# EAGLE design PaddleClock-base-v1b (EAGLE 5.06)
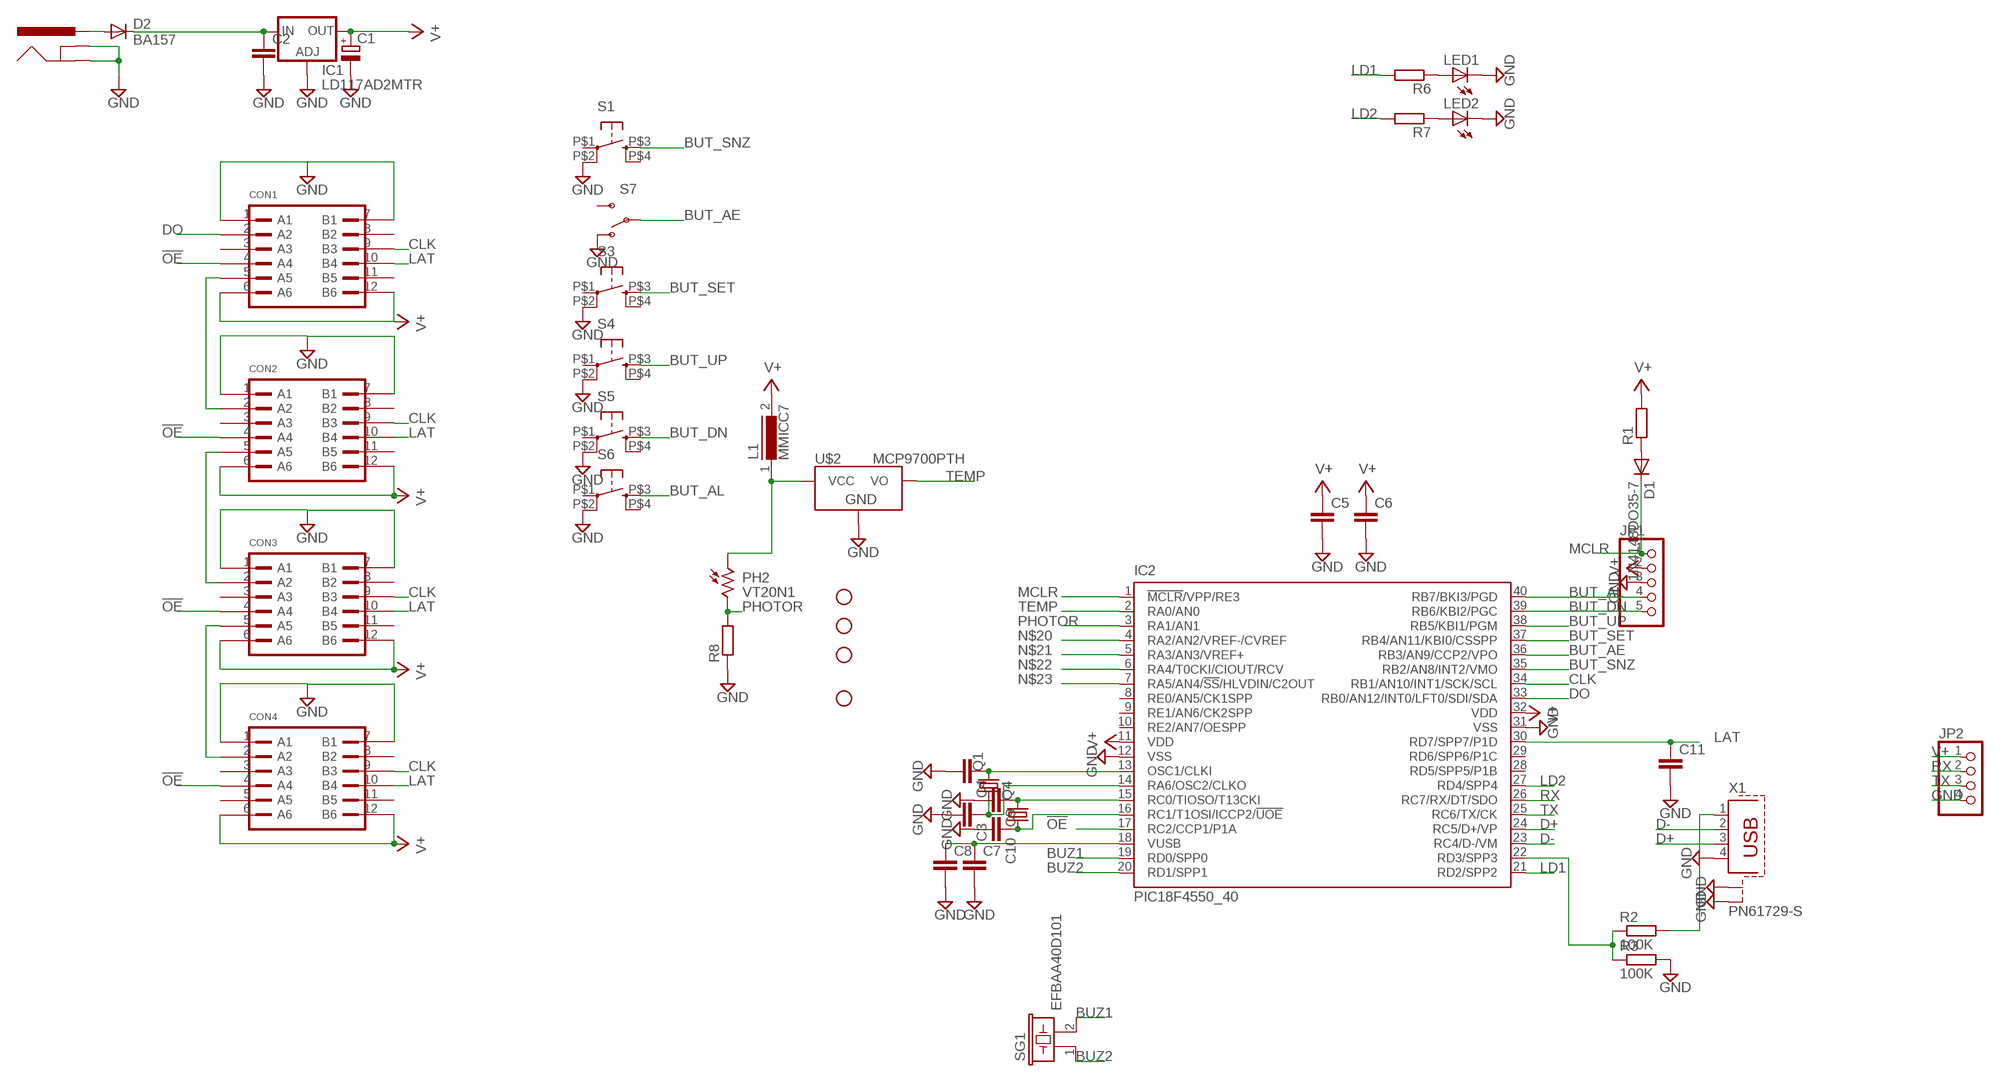
[diagram p0: schematic, sheet 1]

## Parts
C1  CPOL-EUE2.5-7  [E2,5-7]
C2  C-EU025-024X044  [C025-024X044]
C3  C-EU025-024X044  [C025-024X044]
C4  C-EU025-024X044  [C025-024X044]
C5  C-EU025-024X044  [C025-024X044]
C6  C-EU025-024X044  [C025-024X044]
C7  C-EU025-024X044  [C025-024X044]
C8  C-EU025-024X044  [C025-024X044]
C9  C-EU025-024X044  [C025-024X044]
C10  C-EU025-024X044  [C025-024X044]
C11  C-EU025-024X044  [C025-024X044]
CON1  EDGE_CONNECTOR_6X2  [EDGE_CONNECTOR_6X2]
CON2  EDGE_CONNECTOR_6X2  [EDGE_CONNECTOR_6X2]
CON3  EDGE_CONNECTOR_6X2  [EDGE_CONNECTOR_6X2]
CON4  EDGE_CONNECTOR_6X2  [EDGE_CONNECTOR_6X2]
D1  1N4148DO35-7  [DO35-7]
D2  BA157  [P1-10]
IC1  LD117AD2MTR  [D2PACK]
IC2  PIC18F4550_40  [DIL40]
J1  POWER_JACKSMD  [POWER_JACK_SMD]
JP1  PINHD-1X5  [1X05]
JP2  PINHD-1X4  [1X04]
L1  MMICC7  [MMICC7]
LED1  LED3MM  [LED3MM]
LED2  LED3MM  [LED3MM]
PH2  VT20N1  [TO46-VT200]
Q1  CRYSTALHC49U-V  [HC49U-V]
Q4  CRYSTALTC26H  [TC26H]
R1  R-EU_0204/7  [0204/7]
R2  100K  R-EU_0204/7  [0204/7]
R3  100K  R-EU_0204/7  [0204/7]
R6  R-EU_0204/7  [0204/7]
R7  R-EU_0204/7  [0204/7]
R8  R-EU_0204/7  [0204/7]
S1  TAC_SWITCHKSA_SEALED  [KSA_SEALED_TAC_SWITCH]
S3  TAC_SWITCHKSA_SEALED  [KSA_SEALED_TAC_SWITCH]
S4  TAC_SWITCHKSA_SEALED  [KSA_SEALED_TAC_SWITCH]
S5  TAC_SWITCHKSA_SEALED  [KSA_SEALED_TAC_SWITCH]
S6  TAC_SWITCHKSA_SEALED  [KSA_SEALED_TAC_SWITCH]
S7  SWITCH-SPSTPTH  [SWITCH-SPDT]
SG1  EFBAA40D101  [EFBAA40D101]
U$1  STAND-OFF  [STAND-OFF]
U$2  MCP9700PTH  [TO-92]
U$3  STAND-OFF  [STAND-OFF]
U$4  STAND-OFF  [STAND-OFF]
U$5  STAND-OFF  [STAND-OFF]
X1  PN61729-S  [PN61729-S]

## Nets
!OE: CON1.4(A4) CON2.4(A4) CON3.4(A4) CON4.4(A4) IC2.17(RC2/CCP1/P1A)
BUT_AE: IC2.36(RB3/AN9/CCP2/VPO) S7.2(P)
BUT_AL: IC2.40(RB7/BKI3/PGD) JP1.4 S6.P$3
BUT_DN: IC2.39(RB6/KBI2/PGC) JP1.5 S5.P$3
BUT_SET: IC2.37(RB4/AN11/KBI0/CSSPP) S3.P$3
BUT_SNZ: IC2.35(RB2/AN8/INT2/VMO) S1.P$3
BUT_UP: IC2.38(RB5/KBI1/PGM) S4.P$3
BUZ1: IC2.19(RD0/SPP0) SG1.2
BUZ2: IC2.20(RD1/SPP1) SG1.1
CLK: CON1.9(B3) CON2.9(B3) CON3.9(B3) CON4.9(B3) IC2.34(RB1/AN10/INT1/SCK/SCL)
D+: IC2.24(RC5/D+/VP) X1.3
D-: IC2.23(RC4/D-/VM) X1.2
DO: CON1.2(A2) IC2.33(RB0/AN12/INT0/LFT0/SDI/SDA)
GND: C1.- C2.2 C3.2 C4.2 C5.2 C6.2 C7.2 C8.2 C9.2 C10.2 C11.2 CON1.1(A1) CON1.7(B1) CON2.1(A1) CON2.7(B1) CON3.1(A1) CON3.7(B1) CON4.1(A1) CON4.7(B1) IC1.1(ADJ) IC2.12(VSS) IC2.31(VSS) J1.GND(GNDBREAK) J1.P$4(GND) JP1.3 JP2.4 LED1.K(C) LED2.K(C) R3.2 R8.1 S1.P$2 S3.P$2 S4.P$2 S5.P$2 S6.P$2 S7.1(O) U$2.3(GND) X1.4 X1.S1 X1.S2
LAT: C11.1 CON1.10(B4) CON2.10(B4) CON3.10(B4) CON4.10(B4) IC2.30(RD7/SPP7/P1D)
LD1: IC2.21(RD2/SPP2) R6.2
LD2: IC2.27(RD4/SPP4) R7.2
MCLR: D1.C IC2.1(!MCLR!/VPP/RE3) JP1.1
N$3: CON1.5(A5) CON2.2(A2)
N$4: C2.1 D2.C IC1.3(IN)
N$5: CON3.5(A5) CON4.2(A2)
N$8: D1.A R1.1
N$9: R2.2 X1.1
N$10: IC2.22(RD3/SPP3) R2.1 R3.1
N$11: L1.1 PH2.1 U$2.1(VCC)
N$14: LED1.A R6.1
N$15: C7.1 C8.1 IC2.18(VUSB)
N$16: CON2.5(A5) CON3.2(A2)
N$18: LED2.A R7.1
N$20: IC2.4(RA2/AN2/VREF-/CVREF)
N$21: IC2.5(RA3/AN3/VREF+)
N$22: IC2.6(RA4/T0CKI/CIOUT/RCV)
N$23: IC2.7(RA5/AN4/!SS!/HLVDIN/C2OUT)
N$24: D2.A J1.VIN0(PWR)
N$26: C9.1 IC2.15(RC0/TIOSO/T13CKI) Q4.2
N$27: C10.1 IC2.16(RC1/T1OSI/ICCP2/!UOE) Q4.1
N$28: C3.1 IC2.14(RA6/OSC2/CLKO) Q1.1
N$29: C4.1 IC2.13(OSC1/CLKI) Q1.2
PHOTOR: IC2.3(RA1/AN1) PH2.2 R8.2
RX: IC2.26(RC7/RX/DT/SDO) JP2.2
TEMP: IC2.2(RA0/AN0) U$2.2(VO)
TX: IC2.25(RC6/TX/CK) JP2.3
V+: C1.+ C5.1 C6.1 CON1.6(A6) CON1.12(B6) CON2.6(A6) CON2.12(B6) CON3.6(A6) CON3.12(B6) CON4.6(A6) CON4.12(B6) IC1.2(OUT) IC2.11(VDD) IC2.32(VDD) JP1.2 JP2.1 L1.2 R1.2
Unconnected: CON1.3(A3) CON1.8(B2) CON1.11(B5) CON2.3(A3) CON2.8(B2) CON2.11(B5) CON3.3(A3) CON3.8(B2) CON3.11(B5) CON4.3(A3) CON4.5(A5) CON4.8(B2) CON4.11(B5) IC2.8(RE0/AN5/CK1SPP) IC2.9(RE1/AN6/CK2SPP) IC2.10(RE2/AN7/OESPP) IC2.28(RD5/SPP5/P1B) IC2.29(RD6/SPP6/P1C) S1.P$1 S1.P$4 S3.P$1 S3.P$4 S4.P$1 S4.P$4 S5.P$1 S5.P$4 S6.P$1 S6.P$4 S7.3(S)

## Library data of the parts
C1 = rcl:CPOL-EU: POLARIZED CAPACITOR, European symbol
C2-C11 = rcl:C-EU: CAPACITOR, European symbol
CON1-CON4 = dp_devices:EDGE_CONNECTOR_6X2
D1 = diode:1N4148: DIODE high speed (Philips)
D2 = diode:BA157: DIODE fast soft-recovery controlled avalanche rectifier
IC1 = v-reg:LD117A?*: Low drop fixed and adjustable positive voltage regulators 1 A Source: http://www.st.com/stonline/products/literature/ds/7194/ld1117axx.pdf
IC2 = microchip:PIC18F4*_40: USB Microcontrollers with nanoWatt Technology High-Performance, Enhanced Flash, 28/40/44-Pin, Source: http://ww1.microchip.com/downloads/en/devicedoc/39632c.pdf
J1 = SparkFun:POWER_JACK: Power Jack This is the standard 5.5mm barrel jack for power. The PTH is the most common, proven, reliable, footprint. All others are experimental. The Slot footprint only works if the mill layer is transmitted to the PCB fab house so be warned. Spark Fun Electronics SKU : PRT-00119. Mating wall wart : TOL-00298 (and others)
JP1 = pinhead-2:PINHD-1X5: PIN HEADER
JP2 = pinhead-2:PINHD-1X4: PIN HEADER
L1 = inductors:MMICC7: INDUCTOR
LED1 LED2 = led:LED: LED OSRAM: - CHIPLED LG R971, LG N971, LY N971, LG Q971, LY Q971, LO R971, LY R971 LH N974, LH R974 LS Q976, LO Q976, LY Q976 LO Q996 - Hyper CHIPLED LW Q18S LB Q993, LB Q99A, LB R99A - SideLED LS A670, LO A670, LY A670, LG A670, LP A670 LB A673, LV A673, LT A673, LW A673 LH A674 LY A675 LS A676, LA A676, LO A676, LY A676, LW A676 LS A679, LY A679, LG A679 - Hyper Micro SIDELED® LS Y876, LA Y876, LO Y876, LY Y876 LT Y87S - SmartLED LW L88C, LW L88S LB L89C, LB L89S, LG L890 LS L89K, LO L89K, LY L89K LS L896, LA L896, LO L896, LY L896 - TOPLED LS T670, LO T670, LY T670, LG T670, LP T670 LSG T670, LSP T670, LSY T670, LOP T670, LYG T670 LG T671, LOG T671, LSG T671 LB T673, LV T673, LT T673, LW T673 LH T674 LS T676, LA T676, LO T676, LY T676, LB T676, LH T676, LSB T676, LW T676 LB T67C, LV T67C, LT T67C, LS T67K, LO T67K, LY T67K, LW E67C LS E67B, LA E67B, LO E67B, LY E67B, LB E67C, LV E67C, LT E67C LW T67C LS T679, LY T679, LG T679 LS T770, LO T770, LY T770, LG T770, LP T770 LB T773, LV T773, LT T773, LW T773 LH T774 LS E675, LA E675, LY E675, LS T675 LS T776, LA T776, LO T776, LY T776, LB T776 LHGB T686 LT T68C, LB T68C - Hyper Mini TOPLED® LB M676 - Mini TOPLED Santana® LG M470 LS M47K, LO M47K, LY M47K Source: http://www.osram.convergy.de LUXEON: - LUMILED® LXK2-PW12-R00, LXK2-PW12-S00, LXK2-PW14-U00, LXK2-PW14-V00 LXK2-PM12-R00, LXK2-PM12-S00, LXK2-PM14-U00 LXK2-PE12-Q00, LXK2-PE12-R00, LXK2-PE12-S00, LXK2-PE14-T00, LXK2-PE14-U00 LXK2-PB12-K00, LXK2-PB12-L00, LXK2-PB12-M00, LXK2-PB14-N00, LXK2-PB14-P00, LXK2-PB14-Q00 LXK2-PR12-L00, LXK2-PR12-M00, LXK2-PR14-Q00, LXK2-PR14-R00 LXK2-PD12-Q00, LXK2-PD12-R00, LXK2-PD12-S00 LXK2-PH12-R00, LXK2-PH12-S00 LXK2-PL12-P00, LXK2-PL12-Q00, LXK2-PL12-R00 Source: www.luxeon.com KINGBRIGHT: KA-3528ASYC Source: www.kingbright.com
PH2 = photo-elements:VT2*: Photoconductive Cell VT200 Series Source: http://optoelectronics.perkinelmer.com/content/Datasheets/DTS_vt200seriesdatasheet.pdf
Q1 Q4 = crystal:CRYSTAL: CRYSTAL
R1-R3 R6-R8 = rcl:R-EU_: RESISTOR, European symbol
S1 S3-S6 = SparkFun:TAC_SWITCH: Momentary Switch Button commonly used for reset or general input. Spark Fun Electronics SKU : COM-00097
S7 = SparkFun:SWITCH-SPST: SPST Switch Simple slide switch. Spark Fun Electronics SKU : COM-00102
SG1 = buzzer:EFB?: Piezoelectric Acoustic Transducer Source: Panbasonic .. 2SC1685.pdf
U$1 U$3-U$5 = SparkFun:STAND-OFF: Stand Off This is the mechanical footprint for a #4 phillips button head screw. Use the keepout ring to avoid running the screw head into surrounding components. SKU : PRT-00447
U$2 = SparkFun:MCP9700
X1 = con-berg:PN61729-S: BERG USB connector

## Board
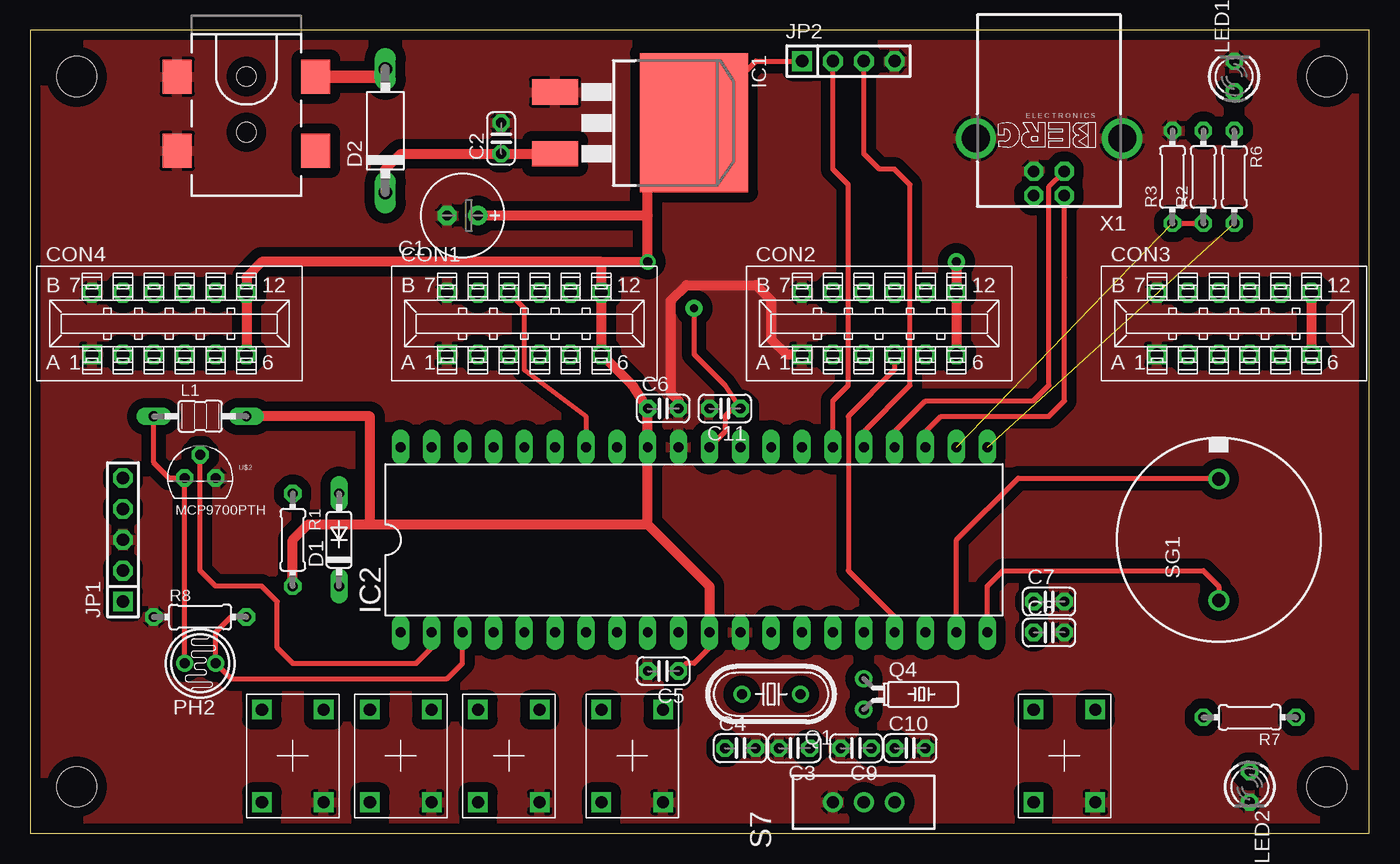
[diagram p1: board, top side]
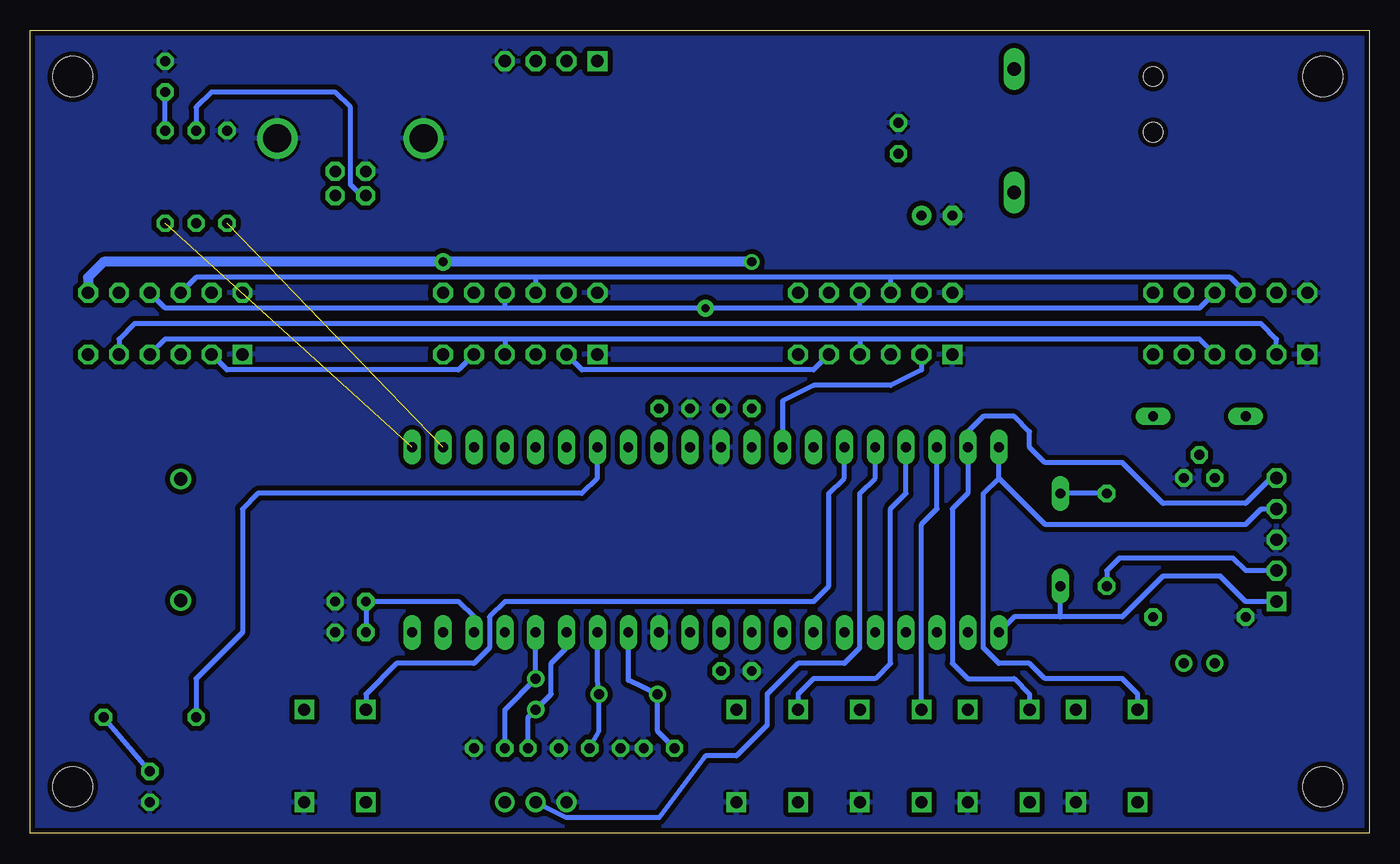
[diagram p2: board, bottom side, seen from below]

Size 110.16 x 66.03 mm. Coordinates in mm from the lower left corner, seen from the top.
Outline: 0,0 110.16,0 110.16,66.03 0,66.03 0,0
Copper layers (1*16): Top 0.035mm / dielectric 1.5mm / Bottom 0.035mm
Design rules "SparkFun": minimum track width 8mil, minimum drill 20mil, track to track 8mil, track to pad 8mil, pad to pad 8mil, via to via 8mil, smd to smd 8mil, copper to edge 10mil, drill to drill 8mil, minimum pad ring 12mil, minimum via ring 10mil, stop-mask expansion 4mil, vias tented up to drill 25mil, thermal gap 10mil

### Footprints (pad centres in the part's own frame; a part is rotated, then mirrored left to right if it is on the bottom)
E2,5-7 = drill 0.813 pad 1.6 round: + -1.27,0 | drill 0.813 pad 1.6 octagon: - 1.27,0
C025-024X044 = drill 0.813 octagon: 1 -1.27,0; 2 1.27,0
EDGE_CONNECTOR_6X2 = drill 1.02 square: 1 -6.35,-2.54 | drill 1.02 octagon: 2 -3.81,-2.54; 3 -1.27,-2.54; 4 1.27,-2.54; 5 3.81,-2.54; 6 6.35,-2.54; 7 -6.35,2.54; 8 -3.81,2.54; 9 -1.27,2.54; 10 1.27,2.54; 11 3.81,2.54; 12 6.35,2.54
DO35-7 = drill 0.813 long: A 3.81,0; C -3.81,0
P1-10 = drill 1.118 long: A 5.08,0; C -5.08,0
D2PACK = smd 2.083 x 3.81: 1 -2.54,-8.89; 3 2.54,-8.89 | smd 11.43 x 8.89: 2 0,2.54
DIL40 = drill 0.813 long: 1 -24.13,-7.62; 2 -21.59,-7.62; 3 -19.05,-7.62; 4 -16.51,-7.62; 5 -13.97,-7.62; 6 -11.43,-7.62; 7 -8.89,-7.62; 8 -6.35,-7.62; 9 -3.81,-7.62; 10 -1.27,-7.62; 11 1.27,-7.62; 12 3.81,-7.62; 13 6.35,-7.62; 14 8.89,-7.62; 15 11.43,-7.62; 16 13.97,-7.62; 17 16.51,-7.62; 18 19.05,-7.62; 19 21.59,-7.62; 20 24.13,-7.62; 21 24.13,7.62; 22 21.59,7.62; 23 19.05,7.62; 24 16.51,7.62; 25 13.97,7.62; 26 11.43,7.62; 27 8.89,7.62; 28 6.35,7.62; 29 3.81,7.62; 30 1.27,7.62; 31 -1.27,7.62; 32 -3.81,7.62; 33 -6.35,7.62; 34 -8.89,7.62; 35 -11.43,7.62; 36 -13.97,7.62; 37 -16.51,7.62; 38 -19.05,7.62; 39 -21.59,7.62; 40 -24.13,7.62
POWER_JACK_SMD = smd 2.8 x 2.4: GND 0,-5.7; P$4 6.1,-5.7; VIN0 0,5.7; VIN1 6.1,5.7 | hole 1.6: 0,0; 4.572,0
1X05 = drill 1.016 square: 1 -5.08,0 | drill 1.016 octagon: 2 -2.54,0; 3 0,0; 4 2.54,0; 5 5.08,0
1X04 = drill 1.016 square: 1 -3.81,0 | drill 1.016 octagon: 2 -1.27,0; 3 1.27,0; 4 3.81,0
MMICC7 = drill 0.813 long: 1 -3.81,0; 2 3.81,0
LED3MM = drill 0.813 octagon: A -1.27,0; K 1.27,0
TO46-VT200 = drill 0.8 pad 1.4 round: 1 -1.27,0; 2 1.27,0
HC49U-V = drill 0.813 round: 1 -2.413,0; 2 2.413,0
TC26H = drill 0.813 round: 1 -1.27,0; 2 1.27,0
0204/7 = drill 0.813 octagon: 1 -3.81,0; 2 3.81,0
KSA_SEALED_TAC_SWITCH = drill 1 square: P$1 -3.81,2.54; P$2 3.81,2.54; P$3 -3.81,-2.54; P$4 3.81,-2.54
SWITCH-SPDT = drill 1.016 round: 1 0,2.54; 2 0,0; 3 0,-2.54
EFBAA40D101 = drill 1.1 pad 1.676 round: 1 -5,0; 2 5,0
STAND-OFF = hole 3.302: 0,0
TO-92 = drill 0.813 octagon: 1 -1.27,0; 2 0,1.905; 3 1.27,0
PN61729-S = drill 0.95 octagon: 1 1.25,4.71; 2 -1.25,4.71; 3 -1.25,2.71; 4 1.25,2.71 | drill 2.3 pad 2.9 round: S1 -6.02,0; S2 6.02,0

### Placement (x,y rotation side)
C1  35.56,50.8 180 top
C2  38.73,57.15 90 top
C3  62.87,6.99 180 top
C4  58.42,6.99 0 top
C5  52.07,13.34 180 top
C6  52.07,34.92 0 top
C7  83.82,19.05 0 top
C8  83.82,16.51 0 top
C9  67.95,6.99 180 top
C10  72.39,6.99 0 top
C11  57.15,34.92 180 top
CON1  40.64,41.91 0 top
CON2  69.85,41.91 0 top
CON3  99.06,41.91 0 top
CON4  11.43,41.91 0 top
D1  25.4,24.13 90 top
D2  29.21,57.78 90 top
IC1  52.07,58.42 270 top
IC2  54.61,24.13 0 top
J1  17.78,62.23 270 top
JP1  7.62,24.13 90 top
JP2  67.31,63.5 0 top
L1  13.97,34.29 0 top
LED1  99.06,62.23 90 top
LED2  100.33,3.81 270 top
PH2  13.97,13.97 0 top
Q1  60.96,11.43 180 top
Q4  68.58,11.43 270 top
R1  21.59,24.13 270 top
R2  96.52,53.98 90 top
R3  93.98,53.98 90 top
R6  99.06,53.98 270 top
R7  100.33,9.53 180 top
R8  13.97,17.78 0 top
S1  85.09,6.35 270 top
S3  49.53,6.35 270 top
S4  39.37,6.35 270 top
S5  30.48,6.35 270 top
S6  21.59,6.35 270 top
S7  68.58,2.54 90 top
SG1  97.79,24.13 90 top
U$1  3.81,62.23 0 top
U$2  13.97,29.21 0 top
U$3  3.81,3.81 0 top
U$4  106.68,3.81 0 top
U$5  106.68,62.23 0 top
X1  83.82,57.15 180 top

### Tracks (layer width: path | path; a pad name or v marks a point on that pad's centre or on a via)
!OE
  Top 0.406: IC2.17 71.12,17.78 67.31,21.59 67.31,34.29 71.12,38.1 CON2.4
  Bottom 0.406: 41.91,40.64 13.97,40.64 CON4.4 | 41.91,40.64 71.12,40.64 | 71.12,40.64 99.06,40.64 CON3.4 | 41.91,40.64 CON1.4 | 71.12,40.64 CON2.4
BUT_AE
  Bottom 0.406: S7.2 66.04,1.27 58.42,1.27 54.61,6.35 52.07,6.35 49.53,8.89 49.53,11.43 46.99,13.97 43.18,13.97 41.91,15.24 41.91,27.94 40.64,29.21 IC2.36
BUT_AL
  Bottom 0.406: S6.P$3 19.05,11.43 20.32,12.7 26.67,12.7 27.94,13.97 30.48,13.97 31.75,15.24 31.75,27.94 30.48,29.21 | 30.48,29.21 IC2.40 | 30.48,29.21 26.67,25.4 10.16,25.4 8.89,26.67 JP1.4
BUT_DN
  Bottom 0.406: S5.P$3 27.94,11.43 29.21,12.7 33.02,12.7 34.29,13.97 34.29,26.67 33.02,27.94 IC2.39 33.02,33.02 31.75,34.29 29.21,34.29 27.94,33.02 27.94,31.75 26.67,30.48 20.32,30.48 16.97,27.13 10.16,27.13 8.08,29.21 JP1.5
BUT_SET
  Bottom 0.406: S3.P$3 46.99,11.43 45.72,12.7 40.64,12.7 39.37,13.97 39.37,26.67 38.1,27.94 IC2.37
BUT_SNZ
  Bottom 0.406: IC2.35 43.18,29.21 44.45,27.94 44.45,20.32 45.72,19.05 71.12,19.05 72.39,17.78 72.39,15.24 73.66,13.97 80.01,13.97 82.55,11.43 S1.P$3
BUT_UP
  Bottom 0.406: S4.P$3 36.83,25.4 35.56,26.67 IC2.38
BUZ1
  Top 0.406: IC2.19 76.2,24.13 81.28,29.21 97.71,29.21 SG1.2
BUZ2
  Top 0.406: IC2.20 78.74,20.32 80.01,21.59 96.52,21.59 97.79,20.32 SG1.1
CLK
  Top 0.406: IC2.34 45.72,34.29 40.64,38.1 40.64,43.18 CON1.9
  Bottom 0.406: CON4.9 11.43,45.72 39.37,45.72 | 39.37,45.72 CON1.9 | 39.37,45.72 68.58,45.72 | 68.58,45.72 CON2.9 | 68.58,45.72 96.52,45.72 CON3.9
D+
  Top 0.406: X1.3 83.82,53.19 83.82,36.83 82.55,35.56 73.66,35.56 71.12,33.02 IC2.24
D-
  Top 0.406: X1.2 85.07,49.55 85.09,45.72 85.09,35.56 83.82,34.29 74.93,34.29 73.66,33.02 IC2.23
DO
  Bottom 0.406: CON1.2 36.83,38.1 39.37,36.83 45.72,36.83 48.26,35.56 IC2.33
GND
  Top 0.813: CON2.1 62.23,39.37 60.96,40.64 60.96,43.81 59.69,45.09 53.98,45.09 52.71,43.81 52.71,36.2 53.34,35.56 C6.2
  pour Bottom (isolate 0.406): 0,66.04 110.49,66.04 110.49,0 0,0
  pour Top (isolate 0.813): 0,66.04 110.49,66.04 110.49,0 0,0
LAT  (via drill 0.64 pad 1.42)
  Top 0.406: IC2.30 57.15,33.02 57.15,34.29 57.79,34.92 C11.1 57.15,36.83 54.61,39.37 v54.61,43.18
  Bottom 0.406: CON4.10 13.97,43.18 41.91,43.18 | 41.91,43.18 CON1.10 | 41.91,43.18 v54.61,43.18 71.12,43.18 | 71.12,43.18 CON2.10 | 71.12,43.18 99.06,43.18 CON3.10
LD1  (1 unrouted)
LD2
  Bottom 0.406: R7.2 96.52,12.7 92.71,16.51 92.71,26.67 91.44,27.94 64.77,27.94 63.5,29.21 IC2.27
MCLR
  Bottom 0.406: 25.4,17.78 20.32,17.78 16.97,21.13 12.24,21.13 10.16,19.05 JP1.1 | 25.4,17.78 29.21,17.78 IC2.1 | 25.4,17.78 D1.C
N$3
  Bottom 0.406: CON1.5 45.72,38.1 64.77,38.1 CON2.2
N$4
  Top 0.813: D2.C 29.21,54.61 30.48,55.88 C2.1 IC1.3
N$5
  Bottom 0.406: CON4.2 7.62,40.64 8.89,41.91 101.6,41.91 102.87,40.64 CON3.5
N$8
  Bottom 0.406: R1.1 D1.A
N$9
  Bottom 0.406: X1.1 82.92,52.44 83.82,53.34 83.82,59.69 85.09,60.96 95.25,60.96 96.52,59.69 R2.2
N$10  (1 unrouted)
  Top 0.406: R3.1 R2.1
N$11
  Top 0.406: PH2.1 U$2.1 11.43,29.21 10.16,30.48 L1.1
N$14
  Bottom 0.406: R6.1 LED1.A
N$15
  Bottom 0.406: IC2.18 73.66,17.78 74.93,19.05 C7.1 C8.1
N$16
  Bottom 0.406: CON3.2 93.98,38.1 74.93,38.1 CON2.5
N$18
  Bottom 0.406: LED2.A R7.1
N$24
  Top 1.016: J1.VIN0 28.57,62.23 D2.A
N$26
  Bottom 0.406: C9.1 69.22,9.53 Q4.2 67.31,11.43 67.31,13.97 66.04,15.24 IC2.15
N$27
  Bottom 0.406: IC2.16 Q4.1 71.12,10.16 C10.1
N$28
  Bottom 0.406: IC2.14 63.5,12.57 Q1.1 63.37,8.38 C3.1
N$29
  Bottom 0.406: IC2.13 60.96,12.57 Q1.2 58.55,8.38 C4.1
PHOTOR
  Top 0.406: R8.2 16.51,17.78 15.24,16.51 PH2.2 16.51,12.7 34.29,12.7 35.56,13.97 IC2.3
RX
  Top 0.406: IC2.26 66.04,35.56 67.31,36.83 67.31,53.34 66.04,54.61 JP2.2
TEMP
  Top 0.406: U$2.2 13.97,21.59 15.24,20.32 19.05,20.32 20.32,19.05 20.32,15.24 21.59,13.97 31.75,13.97 33.02,15.24 IC2.2
TX
  Top 0.406: IC2.25 68.58,33.02 72.39,36.83 72.39,53.34 71.12,54.61 69.85,54.61 68.58,55.88 JP2.3
V+  (via drill 0.76, 0.76 pad 1.42)
  Top 0.406: IC2.11 55.88,15.24 54.61,13.97 53.98,13.97 C5.1 | JP2.1 59.69,63.5 IC1.2
  Top 0.813: 50.8,25.4 IC2.32 C6.1 49.53,36.83 CON1.6 CON1.12 46.99,46.99 | 50.8,25.4 55.88,20.32 IC2.11 | 46.99,46.99 19.05,46.99 17.78,45.72 CON4.12 CON4.6 | 46.99,46.99 v50.8,46.99 50.8,50.8 | v76.2,46.99 CON2.12 CON2.6 | L1.2 27.94,34.29 27.94,25.4 | 27.94,25.4 50.8,25.4 | 27.94,25.4 22.86,25.4 21.59,24.13 R1.2 | 50.8,50.8 50.8,57.15 52.07,58.42 IC1.2 | CON3.12 CON3.6 | 50.8,50.8 C1.+
  Top 1.016: IC1.2 56.77,56.26
  Bottom 0.406: R1.2 21.59,21.59 20.55,22.63 11.2,22.63 10.16,21.59 JP1.2
  Bottom 0.813: CON3.12 105.41,45.72 104.14,46.99 v76.2,46.99 v50.8,46.99

### Text on the board
Top: standard case spacing? | correct buttons? | Check Piezo buzzer